# EAGLE design atmega32 (EAGLE 7.6.0)
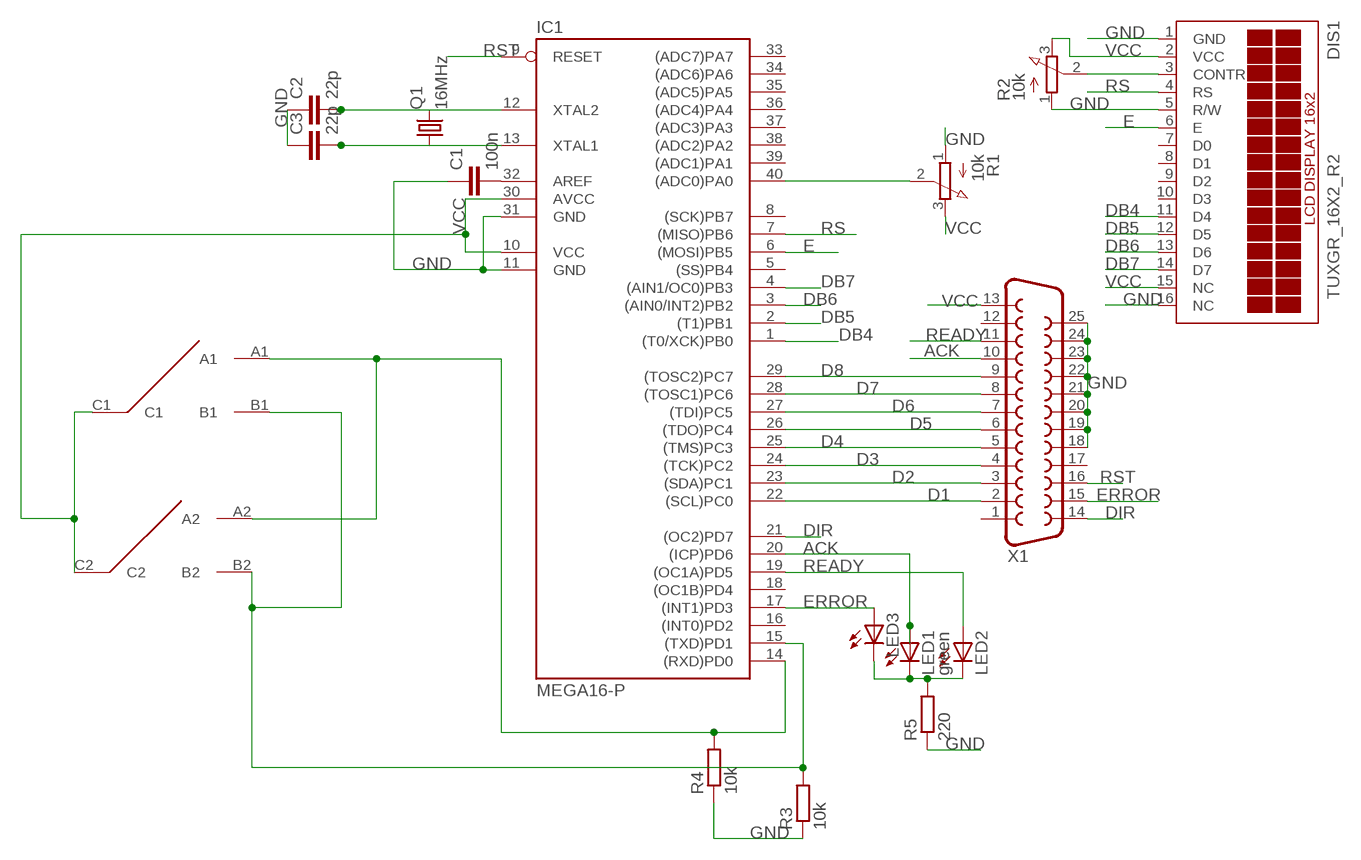
[diagram p0: schematic, sheet 1]

## Parts
C1  100n  C-EU025-025X050  [C025-025X050]
C2  22p  C-EU025-025X050  [C025-025X050]
C3  22p  C-EU025-025X050  [C025-025X050]
DIS1  TUXGR_16X2_R2  [TUXGR_16X2_R2]
IC1  MEGA16-P  [DIL40]
LED1  green  LED3MM  [LED3MM]
LED2  LED3MM  [LED3MM]
LED3  LED3MM  [LED3MM]
Q1  16MHz  CRYSTALHC49S  [HC49/S]
R1  10k  3RP/1610N  [3RP/1610N]
R2  10k  3RP/1610N  [3RP/1610N]
R3  10k  R-EU_0207/10  [0207/10]
R4  10k  R-EU_0207/10  [0207/10]
R5  220  R-EU_0207/10  [0207/10]
U$1  TOGGLE  [TOGGLE]
X1  F25HP  [F25HP]

## Nets
ACK: IC1.20((ICP)PD6) LED1.A X1.10
D1: IC1.22((SCL)PC0) X1.2
D2: IC1.23((SDA)PC1) X1.3
D3: IC1.24((TCK)PC2) X1.4
D4: IC1.25((TMS)PC3) X1.5
D5: IC1.26((TDO)PC4) X1.6
D6: IC1.27((TDI)PC5) X1.7
D7: IC1.28((TOSC1)PC6) X1.8
D8: IC1.29((TOSC2)PC7) X1.9
DB4: DIS1.11(D4) IC1.1((T0/XCK)PB0)
DB5: DIS1.12(D5) IC1.2((T1)PB1)
DB6: DIS1.13(D6) IC1.3((AIN0/INT2)PB2)
DB7: DIS1.14(D7) IC1.4((AIN1/OC0)PB3)
DIR: IC1.21((OC2)PD7) X1.14
E: DIS1.6(E) IC1.6((MOSI)PB5)
ERROR: IC1.17((INT1)PD3) LED3.A X1.15
GND: C1.1 C2.1 C3.1 DIS1.1(GND) DIS1.5(R/W) DIS1.16(NC) IC1.11(GND) IC1.31(GND) R1.1(A) R2.1(A) R3.1 R4.1 R5.1 X1.18 X1.19 X1.20 X1.21 X1.22 X1.23 X1.24 X1.25
N$1: LED1.K(C) LED2.K(C) LED3.K(C) R5.2
N$2: IC1.14((RXD)PD0) R4.2 U$1.A1 U$1.A2
N$3: IC1.15((TXD)PD1) R3.2 U$1.B1 U$1.B2
N$9: C2.2 IC1.12(XTAL2) Q1.2
N$10: IC1.40((ADC0)PA0) R1.2(S)
N$12: C1.2 IC1.32(AREF)
N$15: C3.2 IC1.13(XTAL1) Q1.1
N$17: DIS1.3(CONTR) R2.2(S)
READY: IC1.19((OC1A)PD5) LED2.A X1.11
RS: DIS1.4(RS) IC1.7((MISO)PB6)
RST: IC1.9(RESET) X1.16
VCC: DIS1.2(VCC) DIS1.15(NC) IC1.10(VCC) IC1.30(AVCC) R1.3(E) R2.3(E) U$1.C1 U$1.C2 X1.13
Unconnected: DIS1.7(D0) DIS1.8(D1) DIS1.9(D2) DIS1.10(D3) IC1.5((SS)PB4) IC1.8((SCK)PB7) IC1.16((INT0)PD2) IC1.18((OC1B)PD4) IC1.33((ADC7)PA7) IC1.34((ADC6)PA6) IC1.35((ADC5)PA5) IC1.36((ADC4)PA4) IC1.37((ADC3)PA3) IC1.38((ADC2)PA2) IC1.39((ADC1)PA1) X1.1 X1.12 X1.17

## Library data of the parts
C1-C3 = rcl:C-EU: CAPACITOR, European symbol
DIS1 = display-lcd:TUXGR_16X2_R2: Tuxgraphics LCD display 16x2 characters reflective, without background light Source: tuxgr_12x2_r2.pdf; OC_FARNELL: unknown; OC_NEWARK: unknown
IC1 = atmel:MEGA16-P: MICROCONTROLLER 16 Kbytes FLASH 1 kbytes SRAM 512 bytes EEPROM USART 8-channel 10 bit ADC Source: avr.lbr; MPN: ATMEGA16-16PU; OC_FARNELL: 9171142; OC_NEWARK: 01M6885
LED1-LED3 = led:LED: LED OSRAM: - CHIPLED LG R971, LG N971, LY N971, LG Q971, LY Q971, LO R971, LY R971 LH N974, LH R974 LS Q976, LO Q976, LY Q976 LO Q996 - Hyper CHIPLED LW Q18S LB Q993, LB Q99A, LB R99A - SideLED LS A670, LO A670, LY A670, LG A670, LP A670 LB A673, LV A673, LT A673, LW A673 LH A674 LY A675 LS A676, LA A676, LO A676, LY A676, LW A676 LS A679, LY A679, LG A679 - Hyper Micro SIDELED® LS Y876, LA Y876, LO Y876, LY Y876 LT Y87S - SmartLED LW L88C, LW L88S LB L89C, LB L89S, LG L890 LS L89K, LO L89K, LY L89K LS L896, LA L896, LO L896, LY L896 - TOPLED LS T670, LO T670, LY T670, LG T670, LP T670 LSG T670, LSP T670, LSY T670, LOP T670, LYG T670 LG T671, LOG T671, LSG T671 LB T673, LV T673, LT T673, LW T673 LH T674 LS T676, LA T676, LO T676, LY T676, LB T676, LH T676, LSB T676, LW T676 LB T67C, LV T67C, LT T67C, LS T67K, LO T67K, LY T67K, LW E67C LS E67B, LA E67B, LO E67B, LY E67B, LB E67C, LV E67C, LT E67C LW T67C LS T679, LY T679, LG T679 LS T770, LO T770, LY T770, LG T770, LP T770 LB T773, LV T773, LT T773, LW T773 LH T774 LS E675, LA E675, LY E675, LS T675 LS T776, LA T776, LO T776, LY T776, LB T776 LHGB T686 LT T68C, LB T68C - Hyper Mini TOPLED® LB M676 - Mini TOPLED Santana® LG M470 LS M47K, LO M47K, LY M47K Source: http://www.osram.convergy.de LUXEON: - LUMILED® LXK2-PW12-R00, LXK2-PW12-S00, LXK2-PW14-U00, LXK2-PW14-V00 LXK2-PM12-R00, LXK2-PM12-S00, LXK2-PM14-U00 LXK2-PE12-Q00, LXK2-PE12-R00, LXK2-PE12-S00, LXK2-PE14-T00, LXK2-PE14-U00 LXK2-PB12-K00, LXK2-PB12-L00, LXK2-PB12-M00, LXK2-PB14-N00, LXK2-PB14-P00, LXK2-PB14-Q00 LXK2-PR12-L00, LXK2-PR12-M00, LXK2-PR14-Q00, LXK2-PR14-R00 LXK2-PD12-Q00, LXK2-PD12-R00, LXK2-PD12-S00 LXK2-PH12-R00, LXK2-PH12-S00 LXK2-PL12-P00, LXK2-PL12-Q00, LXK2-PL12-R00 Source: www.luxeon.com KINGBRIGHT: KA-3528ASYC Source: www.kingbright.com
Q1 = crystal:CRYSTAL: CRYSTAL; OC_FARNELL: 1667008; OC_NEWARK: unknown
R1 R2 = pot:3RP/1610N: 16mm Potentiometer one level Source: http://www.alphapotentiometers.net/html/16mm_pot_2.html
R3-R5 = rcl:R-EU_: RESISTOR, European symbol
U$1 = switch 1:TOGGLE
X1 = con-subd:F25: SUB-D; OC_FARNELL: unknown; OC_NEWARK: unknown

## Net classes
0 default: width 0.61 mm, clearance 0.305 mm

## Board
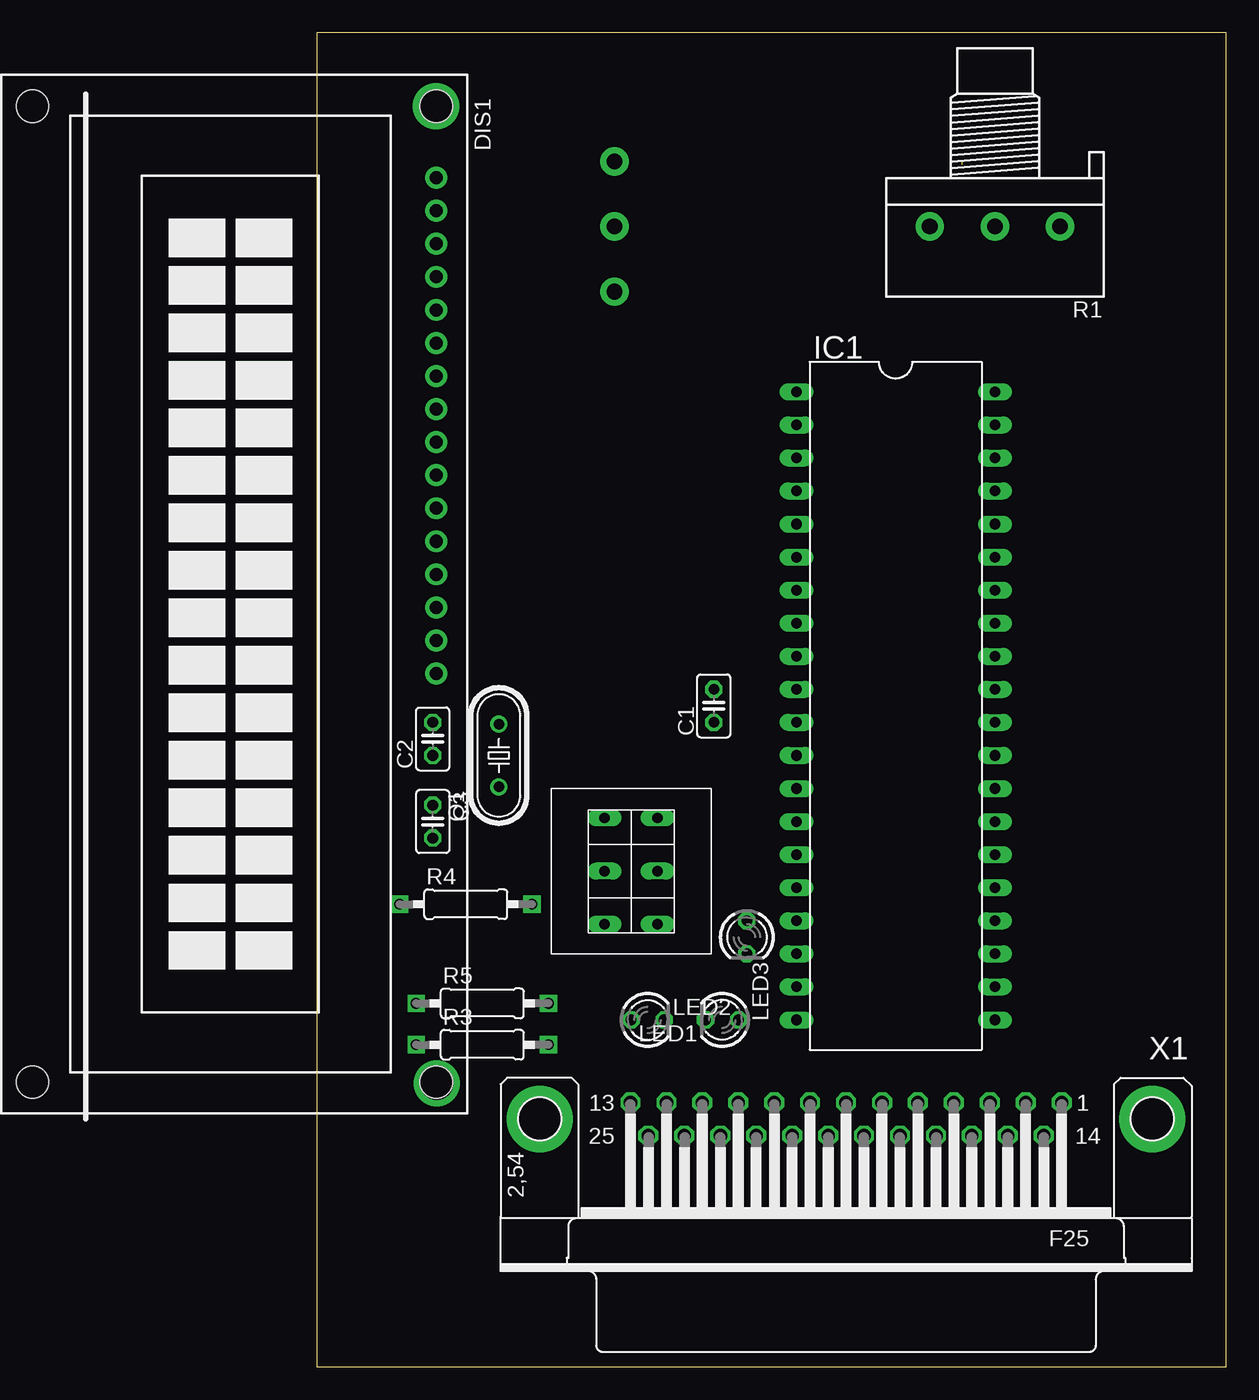
[diagram p1: board, top side]
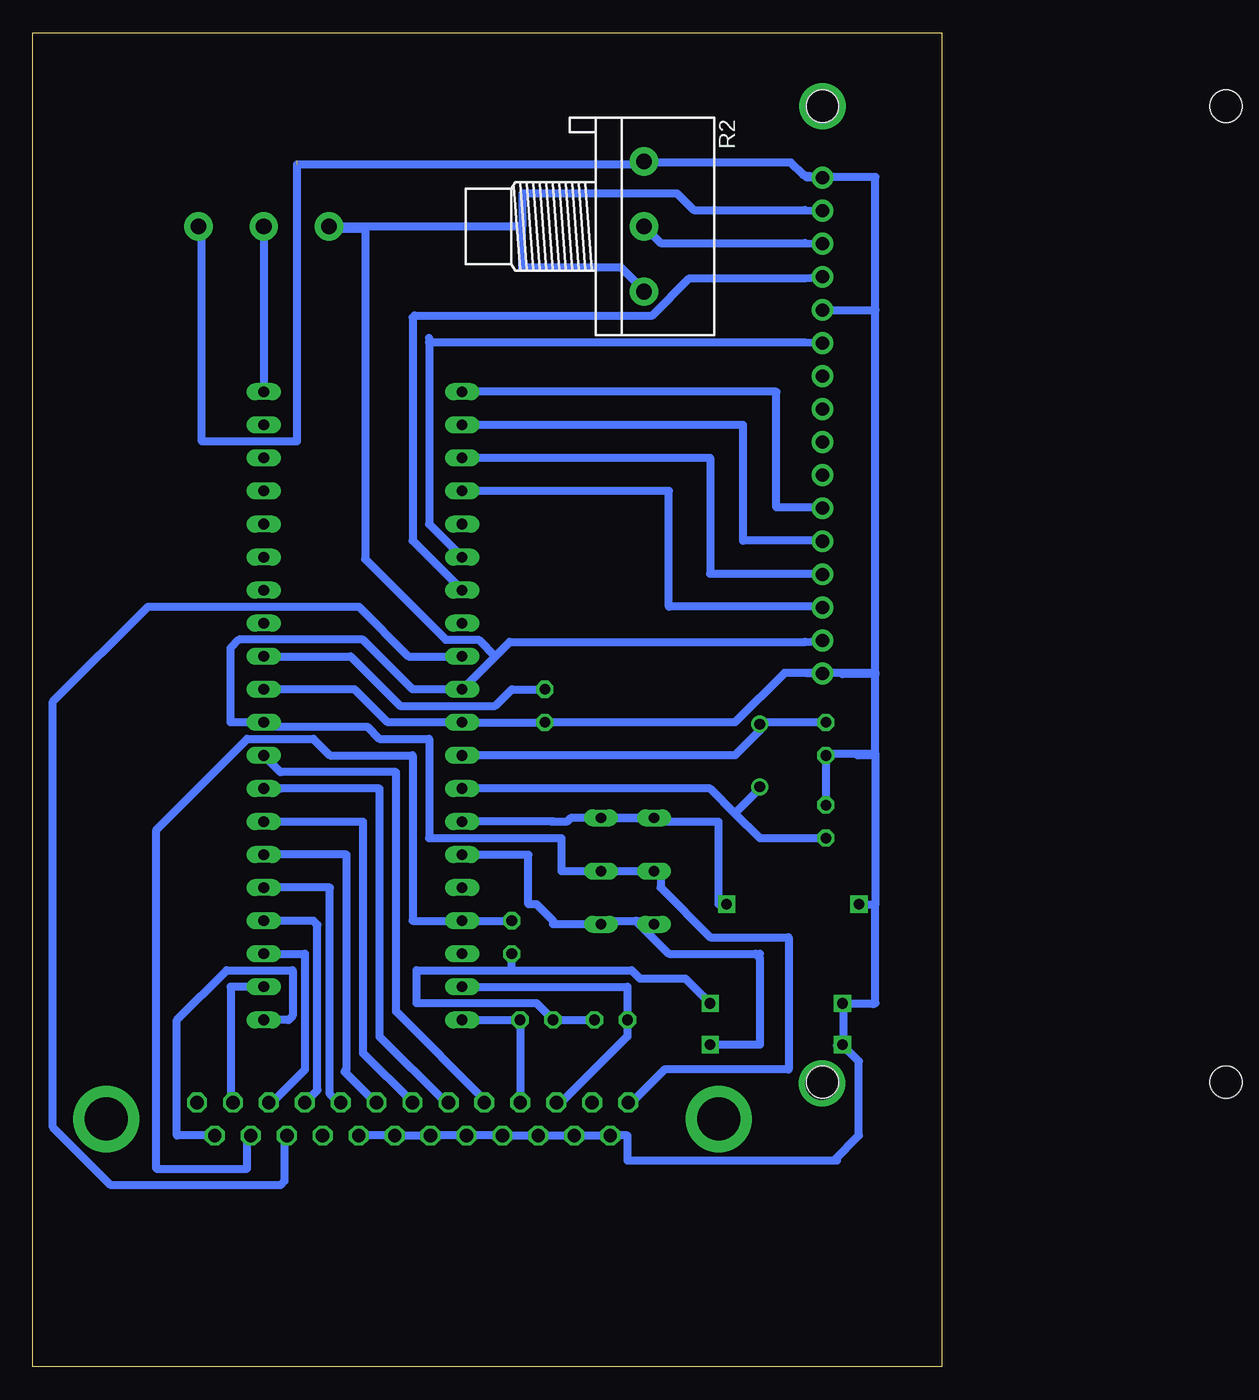
[diagram p2: board, bottom side, seen from below]

Size 69.83 x 102.54 mm. Coordinates in mm from the lower left corner, seen from the top.
Outline: 0,0 69.83,0 69.83,102.54 0,102.54 0,0
Copper layers (1*16): Top 0.035mm / dielectric 1.5mm / Bottom 0.035mm
Design rules "default": minimum track width 10mil, minimum drill 24mil, track to track 8mil, track to pad 8mil, pad to pad 8mil, via to via 8mil, smd to smd 8mil, copper to edge 40mil, drill to drill 8mil, minimum pad ring 10mil, minimum via ring 8mil, stop-mask expansion 4mil, vias tented up to drill 0mil, thermal gap 10mil

### Footprints (pad centres in the part's own frame; a part is rotated, then mirrored left to right if it is on the bottom)
C025-025X050 = drill 0.813 octagon: 1 -1.27,0; 2 1.27,0
TUXGR_16X2_R2 = drill 1 pad 1.676: 1 -32,15.5; 2 -29.46,15.5; 3 -26.92,15.5; 4 -24.38,15.5; 5 -21.84,15.5; 6 -19.3,15.5; 7 -16.76,15.5; 8 -14.22,15.5; 9 -11.68,15.5; 10 -9.14,15.5; 11 -6.6,15.5; 12 -4.06,15.5; 13 -1.52,15.5; 14 1.02,15.5; 15 3.56,15.5; 16 6.1,15.5 | hole 2.5: -37.5,-15.5; 37.5,-15.5; -37.5,15.5; 37.5,15.5
DIL40 = drill 0.813 long: 1 -24.13,-7.62; 2 -21.59,-7.62; 3 -19.05,-7.62; 4 -16.51,-7.62; 5 -13.97,-7.62; 6 -11.43,-7.62; 7 -8.89,-7.62; 8 -6.35,-7.62; 9 -3.81,-7.62; 10 -1.27,-7.62; 11 1.27,-7.62; 12 3.81,-7.62; 13 6.35,-7.62; 14 8.89,-7.62; 15 11.43,-7.62; 16 13.97,-7.62; 17 16.51,-7.62; 18 19.05,-7.62; 19 21.59,-7.62; 20 24.13,-7.62; 21 24.13,7.62; 22 21.59,7.62; 23 19.05,7.62; 24 16.51,7.62; 25 13.97,7.62; 26 11.43,7.62; 27 8.89,7.62; 28 6.35,7.62; 29 3.81,7.62; 30 1.27,7.62; 31 -1.27,7.62; 32 -3.81,7.62; 33 -6.35,7.62; 34 -8.89,7.62; 35 -11.43,7.62; 36 -13.97,7.62; 37 -16.51,7.62; 38 -19.05,7.62; 39 -21.59,7.62; 40 -24.13,7.62
LED3MM = drill 0.813 octagon: A -1.27,0; K 1.27,0
HC49/S = drill 0.813: 1 -2.413,0; 2 2.413,0
3RP/1610N = drill 1.2 pad 2.184: 1 -5,0; 2 0,0; 3 5,0
0207/10 = drill 0.813 square: 1 -5.08,0; 2 5.08,0
TOGGLE = drill 0.8 long: A1 2.032,4.089; A2 -2.032,4.089; B1 2.032,-4.089; B2 -2.032,-4.089; C1 2.032,0; C2 -2.032,0
F25HP = drill 1.016 octagon: 1 -16.561,-1.27; 2 -13.792,-1.27; 3 -11.049,-1.27; 4 -8.28,-1.27; 5 -5.512,-1.27; 6 -2.769,-1.27; 7 0,-1.27; 8 2.769,-1.27; 9 5.512,-1.27; 10 8.28,-1.27; 11 11.049,-1.27; 12 13.792,-1.27; 13 16.561,-1.27; 14 -15.189,1.27; 15 -12.421,1.27; 16 -9.652,1.27; 17 -6.909,1.27; 18 -4.14,1.27; 19 -1.372,1.27; 20 1.372,1.27; 21 4.14,1.27; 22 6.909,1.27; 23 9.652,1.27; 24 12.421,1.27; 25 15.189,1.27 | drill 3.302 pad 5.08: G1 -23.52,0; G2 23.52,0

### Placement (x,y rotation side)
C1  30.48,50.8 90 top
C2  8.89,48.26 90 top
C3  8.89,41.91 270 top
DIS1  -6.35,59.39 270 top
IC1  44.45,50.8 270 top
LED1  31.12,26.67 180 top
LED2  25.4,26.67 0 top
LED3  33.02,33.02 270 top
Q1  13.97,46.99 90 top
R1  52.07,87.63 180 top
R2  22.86,87.63 270 bottom
R3  12.7,24.77 0 top
R4  11.43,35.56 0 top
R5  12.7,27.94 0 top
U$1  24.13,38.1 0 top
X1  40.64,19.05 180 top

### Tracks (layer width: path | path; a pad name or v marks a point on that pad's centre or on a via)
ACK
  Bottom 0.61: IC1.20 LED1.A 32.38,20.32 X1.10
D1
  Bottom 0.61: 54.61,20.32 X1.2 54.61,20.5 54.61,29.21 IC1.22
D2
  Bottom 0.61: X1.3 51.43,20.32 48.9,22.86 48.9,31.75 IC1.23
D3
  Bottom 0.61: X1.4 48.9,20.32 47.94,21.27 47.94,33.97 48.26,34.29 IC1.24
D4
  Bottom 0.61: X1.5 46.35,20.32 46.99,20.95 46.99,36.83 IC1.25
D5
  Bottom 0.61: X1.6 43.5,20.32 45.88,22.7 45.72,22.86 45.72,39.37 IC1.26
D6
  Bottom 0.61: X1.7 44.45,24.13 44.45,41.91 IC1.27
D7
  Bottom 0.61: X1.8 38.1,20.32 43.18,25.4 43.18,44.45 IC1.28 50.8,44.45
D8
  Bottom 0.61: X1.9 34.92,20.32 41.91,27.3 41.91,45.72 50.8,45.72 IC1.29
DB4
  Bottom 0.61: IC1.1 12.7,74.93 12.7,66.04 9.52,66.04 DIS1.11
DB5
  Bottom 0.61: IC1.2 15.24,72.39 15.24,63.5 9.52,63.5 DIS1.12
DB6
  Bottom 0.61: IC1.3 17.78,69.85 17.78,60.96 9.52,60.96 DIS1.13
DB7
  Bottom 0.61: IC1.4 20.95,67.31 20.95,58.42 9.52,58.42 DIS1.14
DIR
  Bottom 0.61: X1.14 58.74,17.78 58.74,26.67 54.93,30.48 49.85,30.48 49.85,26.99 50.16,26.67 IC1.21
E
  Bottom 0.61: IC1.6 39.37,64.77 39.37,78.74 | 39.37,79.07 39.37,78.74 | 39.37,78.74 10.48,78.74 DIS1.6
ERROR
  Bottom 0.61: 53.34,17.78 X1.15 53.34,17.5 53.34,15.24 60.32,15.24 60.32,41.27 53.34,48.26 48.26,48.26 46.99,46.99 40.64,46.99 40.64,34.29 IC1.17 LED3.A
GND  (1 unrouted)
  Bottom 0.61: R1.1 56.83,87.63 56.83,71.12 49.53,71.12 49.53,92.39 23.02,92.39 R2.1 22.86,92.55 11.59,92.55 10.64,91.6 DIS1.1 | X1.18 X1.19 X1.20 X1.21 X1.22 X1.23 X1.24 X1.25 24.13,17.78 24.13,15.88 8.25,15.88 | C3.1 C2.1 8.89,47.09 5.08,47.09 | IC1.31 45.09,52.07 42.55,49.53 IC1.11 C1.1 15.88,49.53 12.06,53.34 10.16,53.34 10.16,53.33 | 5.08,35.56 5.08,27.94 5.28,27.89 7.57,27.89 | 8.25,15.88 8.03,15.88 | R4.1 5.08,35.56 | 7.57,27.89 7.57,25.15 R3.1 | 7.57,27.89 R5.1 | 8.03,24.69 R3.1 | 5.08,53.33 5.08,81.22 | DIS1.5 5.08,81.22 | 10.32,91.44 DIS1.1 | 5.08,81.22 5.08,91.44 10.42,91.44 DIS1.1 | 5.08,53.33 10.16,53.33 | 10.16,53.33 10.42,53.33 DIS1.16 | 5.08,47.09 6.45,46.99 5.08,46.99 5.08,35.56 | 5.08,47.09 5.08,53.24 7.62,53.24 5.08,53.33 | R3.1 6.35,23.5 6.35,17.78 8.25,15.88
N$1
  Bottom 0.61: LED2.K LED1.K 31.12,27.94 40.32,27.94 40.32,30.48 33.02,30.48 | R5.2 19.69,29.84 23.18,29.84 23.81,30.48 33.02,30.48 | 33.02,30.48 LED3.K
N$2
  Bottom 0.61: 29.97,41.91 29.85,41.92 | U$1.A2 U$1.A1 26.19,42.22 28.45,42.22 28.74,41.92 29.85,41.92 | U$1.A2 25.4,42.19 25.4,41.91 | R4.2 17.15,35.56 17.15,41.91 21.59,41.91 U$1.A2 | IC1.14 29.84,41.91 29.85,41.92
N$3
  Bottom 0.61: IC1.15 31.75,39.37 31.75,35.56 31.12,35.56 29.84,34.29 29.84,34.01 U$1.B1 26.03,34.29 23.49,34.29 | R3.2 13.97,24.77 13.97,31.43 14.13,31.59 | 14.29,31.75 14.13,31.59 | 23.49,34.29 22.23,34.29 U$1.B2 | 23.49,34.29 20.95,31.75 13.97,31.75 14.13,31.59
N$4  (via drill 2.54 pad 2.54)
  other vias: 9.19,21.79
N$5  (via drill 2.54 pad 2.54)
  other vias: 9.14,96.88
N$9
  Bottom 0.61: C2.2 13.97,49.53 Q1.2 13.97,48.9 15.88,46.99 IC1.12
N$10
  Bottom 0.61: R1.2 IC1.40
N$12
  Bottom 0.61: C1.2 33.02,52.07 34.29,50.8 41.59,50.8 45.4,54.61 IC1.32
N$15
  Bottom 0.61: C3.2 13.97,40.64 15.88,42.55 | 15.88,42.55 17.78,44.45 IC1.13 | 15.88,42.55 13.97,44.45 Q1.1
N$17
  Bottom 0.61: R2.2 21.59,86.36 10.48,86.36 DIS1.3
READY
  Bottom 0.61: IC1.19 24.13,29.21 LED2.A 24.13,25.4 29.21,20.32 X1.11
RS
  Bottom 0.61: IC1.7 40.64,63.5 40.64,80.64 40.48,80.8 22.23,80.8 19.37,83.66 10.48,83.66 DIS1.4
RST
  Bottom 0.61: IC1.9 40.96,54.61 44.77,58.42 60.96,58.42 68.26,51.12 68.26,18.41 63.82,13.97 50.8,13.97 50.48,14.29 50.48,17.78 X1.16
VCC
  Bottom 0.61: U$1.C2 U$1.C1 29.21,38.1 29.21,40.64 39.37,40.64 39.37,48.26 43.18,48.26 44.13,49.21 51.75,49.21 IC1.30 54.61,49.53 54.61,55.24 53.98,55.88 44.45,55.88 40.64,52.07 IC1.10 34.29,54.61 | 24.13,20.32 X1.13 23.81,20.32 21.27,22.86 11.75,22.86 11.75,33.02 17.78,33.02 21.59,36.83 21.59,38.1 U$1.C2 | 25.72,38.1 U$1.C2 | 34.29,54.61 33.18,55.72 10.48,55.72 DIS1.15 | DIS1.2 10.48,88.9 19.05,88.9 20.32,90.17 32.21,90.17 32.21,89.1 32.23,87.83 32.23,87.63 | R2.3 22.86,82.71 24.61,84.45 32.23,84.45 32.23,87.63 | 32.23,87.63 R1.3 47.31,87.47 44.29,87.47 44.29,62.07 38.1,55.88 35.56,55.88 34.29,54.61